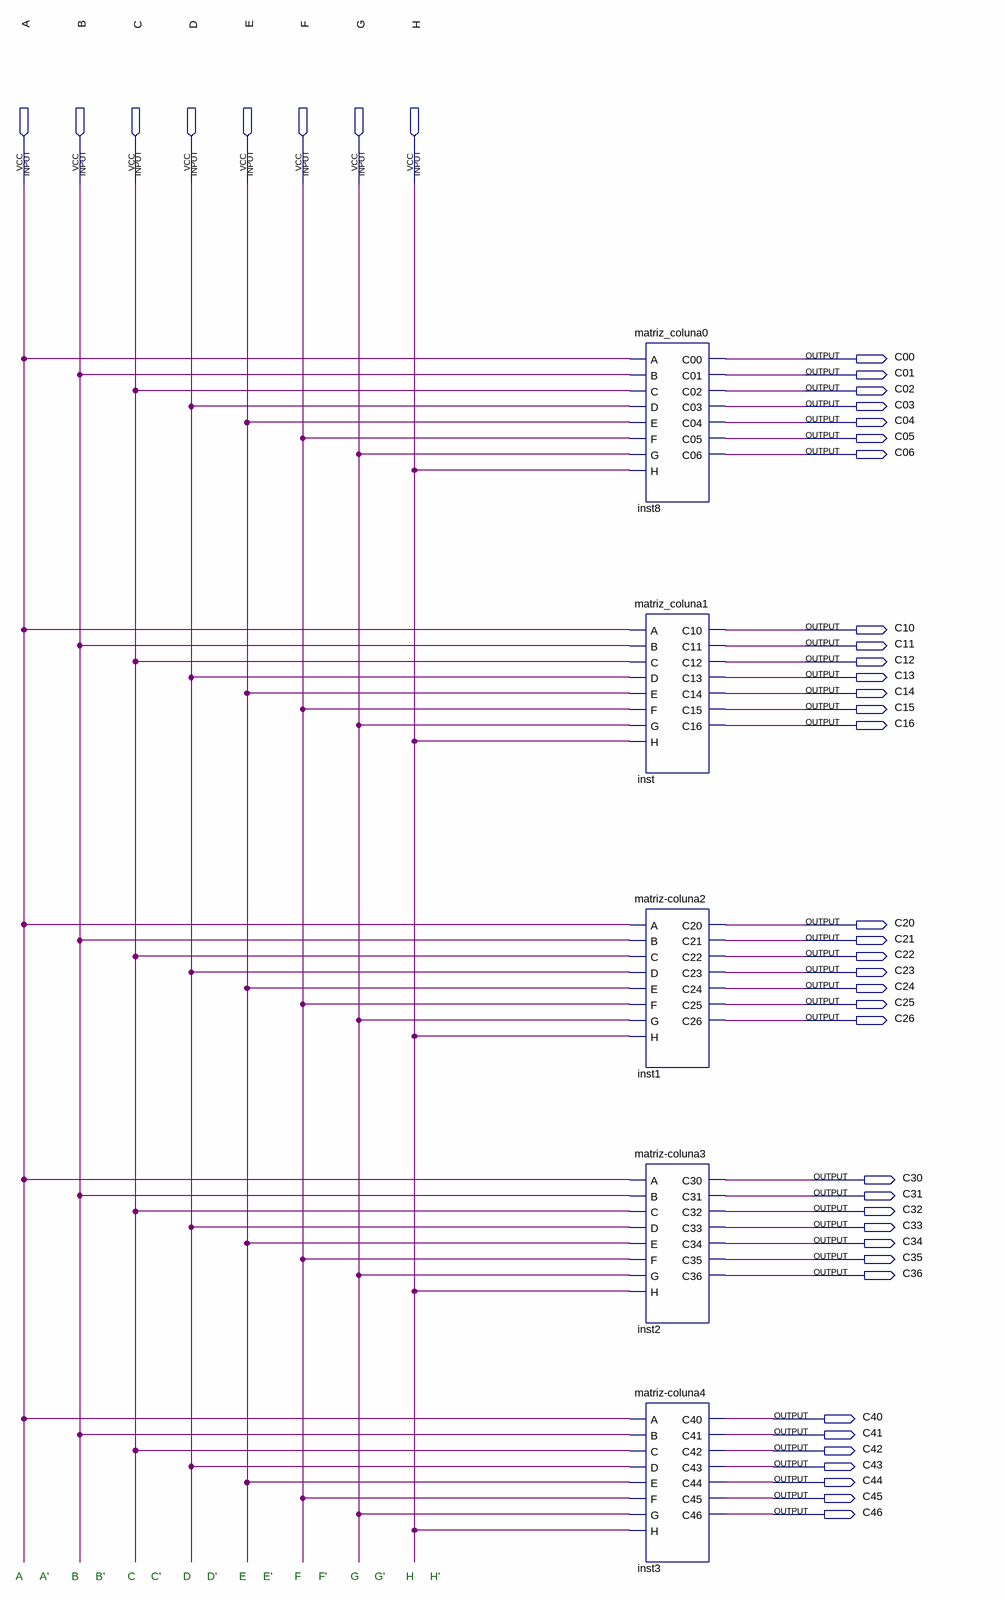
[diagram p0: schematic sheet]
// Quartus schematic decodificador.bdf as structural Verilog: 5 symbols, 43 pins
module decodificador (
  input  A,
  input  B,
  input  C,
  input  D,
  input  E,
  input  F,
  input  G,
  input  H,
  output C00,
  output C01,
  output C02,
  output C03,
  output C04,
  output C05,
  output C06,
  output C10,
  output C11,
  output C12,
  output C13,
  output C14,
  output C15,
  output C16,
  output C20,
  output C21,
  output C22,
  output C23,
  output C24,
  output C25,
  output C26,
  output C30,
  output C31,
  output C32,
  output C33,
  output C34,
  output C35,
  output C36,
  output C40,
  output C41,
  output C42,
  output C43,
  output C44,
  output C45,
  output C46
);

  matriz_coluna0 inst8 (
    .A(A), .B(B), .C(C), .D(D), .E(E), .F(F), .G(G), .H(H), .C00(C00), .C01(C01), .C02(C02), .C03(C03),
    .C04(C04), .C05(C05), .C06(C06));
  matriz_coluna1 inst (
    .A(A), .B(B), .C(C), .D(D), .E(E), .F(F), .G(G), .H(H), .C10(C10), .C11(C11), .C12(C12), .C13(C13),
    .C14(C14), .C15(C15), .C16(C16));
  \matriz-coluna2  inst1 (
    .A(A), .B(B), .C(C), .D(D), .E(E), .F(F), .G(G), .H(H), .C20(C20), .C21(C21), .C22(C22), .C23(C23),
    .C24(C24), .C25(C25), .C26(C26));
  \matriz-coluna3  inst2 (
    .A(A), .B(B), .C(C), .D(D), .E(E), .F(F), .G(G), .H(H), .C30(C30), .C31(C31), .C32(C32), .C33(C33),
    .C34(C34), .C35(C35), .C36(C36));
  \matriz-coluna4  inst3 (
    .A(A), .B(B), .C(C), .D(D), .E(E), .F(F), .G(G), .H(H), .C40(C40), .C41(C41), .C42(C42), .C43(C43),
    .C44(C44), .C45(C45), .C46(C46));

  // Notes on the sheet:
  //   A
  //   A'
  //   B
  //   B'
  //   C
  //   C'
  //   D
  //   D'
  //   E
  //   E'
  //   F
  //   F'
  //   G
  //   G'
  //   H
  //   H'
endmodule
